# Altium schematic sheet ethernet.SchDoc
size A
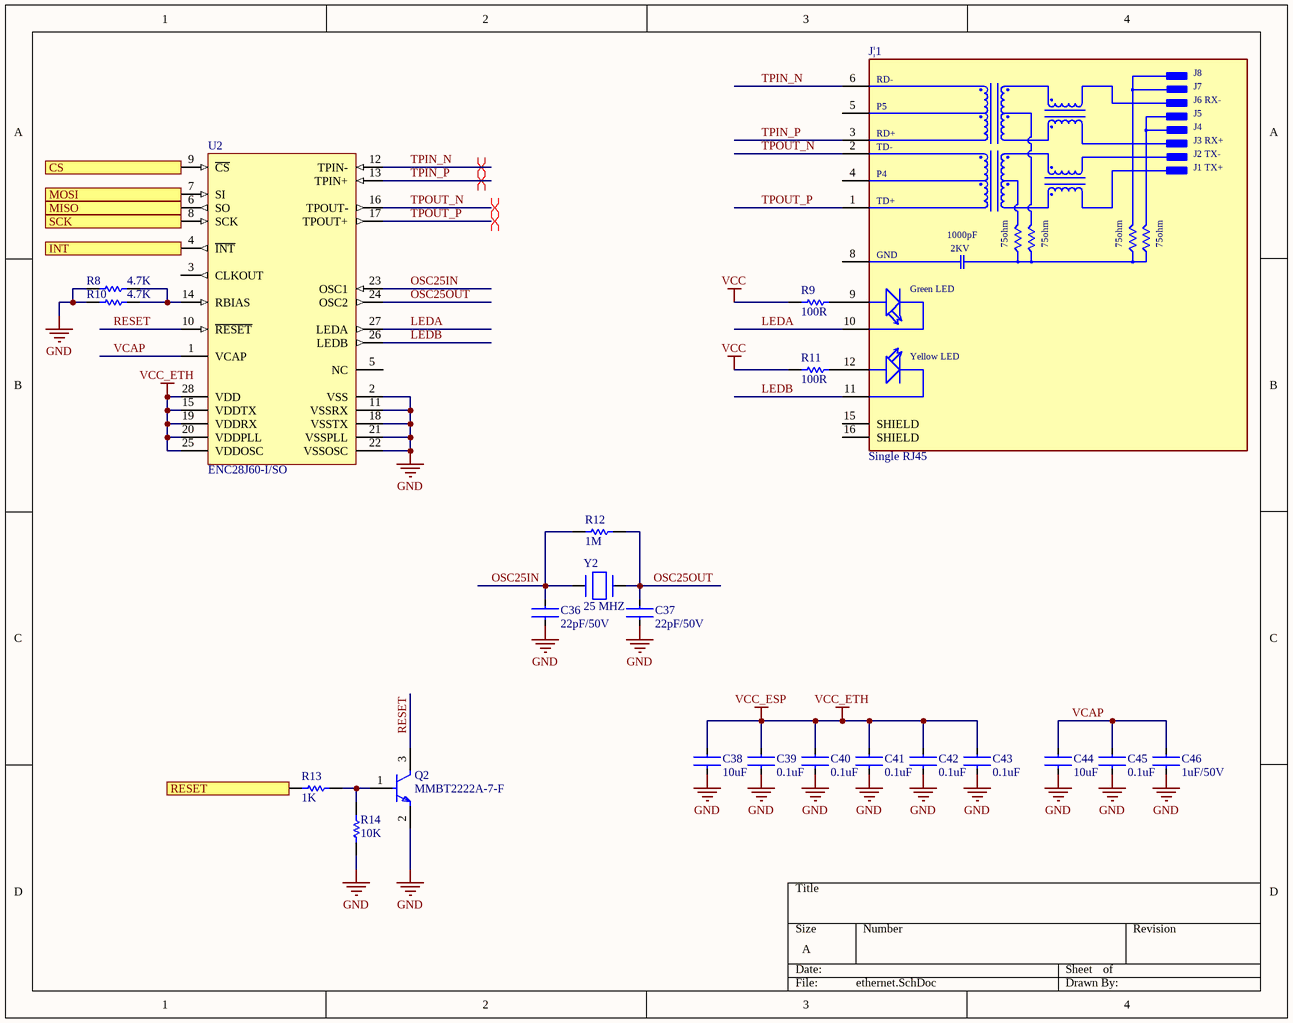
[diagram p0: ethernet.SchDoc]

## Parts
C36  22pF/50V  [C0402]
C37  22pF/50V  [C0402]
C38  10uF  [C0402]
C39  0.1uF  [C0402]
C40  0.1uF  [C0402]
C41  0.1uF  [C0402]
C42  0.1uF  [C0402]
C43  0.1uF  [C0402]
C44  10uF  [C0402]
C45  0.1uF  [C0402]
C46  1uF/50V  [C0402]
J|1  Single RJ45  [HANRUN_HR911105A]
Q2  MMBT2222A-7-F  [Diodes_SOT23_IPC_B]
R8  4.7K  [R0402]
R9  100R  [R0402]
R10  4.7K  [R0402]
R11  100R  [R0402]
R12  1M  [R0402]
R13  1K  [R0402]
R14  10K  [R0402]
U2  ENC28J60-I/SO  [SOIC-SO28_N]
Y2  25 MHZ  [CTS_ATS080B_0]

## Ports
CS, INT, MISO, MOSI, RESET, SCK

## Nets
GND: C36.2 C37.2 C38.2 C39.2 C40.2 C41.2 C42.2 C43.2 C44.2 C45.2 C46.2 Q2.2(E) R8.1 R10.1 R14.1 U2.2(VSS) U2.11(VSSRX) U2.18(VSSTX) U2.21(VSSPLL) U2.22(VSSOSC)
VCC: R9.1 R11.1
VCC_ESP: C38.1 C39.1 C40.1 C41.1 C42.1 C43.1 U2.15(VDDTX) U2.19(VDDRX) U2.20(VDDPLL) U2.25(VDDOSC) U2.28(VDD)  [also labelled VCC_ETH]
CS: U2.9(~{CS}) ; port CS
INT: U2.4(~{INT}) ; port INT
LEDA: J|1.10(GC) U2.27(LEDA)
LEDB: J|1.11(YC) U2.26(LEDB)
MISO: U2.6(SO) ; port MISO
MOSI: U2.7(SI) ; port MOSI
OSC25IN: C36.1 R12.1 U2.23(OSC1) Y2.1
OSC25OUT: C37.1 R12.2 U2.24(OSC2) Y2.2
RESET: Q2.3(C) U2.10(~{RESET})
RESET: R13.1 ; port RESET  [a separate net that carries the same name]
SCK: U2.8(SCK) ; port SCK
TPIN_N: J|1.6(RD-) U2.12(TPIN-)
TPIN_P: J|1.3(RD+) U2.13(TPIN+)
TPOUT_N: J|1.2(TD-) U2.16(TPOUT-)
TPOUT_P: J|1.1(TD+) U2.17(TPOUT+)
VCAP: C44.1 C45.1 C46.1 U2.1(VCAP)
NetJ|1_9: J|1.9(GA) R9.2
NetJ|1_12: J|1.12(YA) R11.2
NetQ2_1: Q2.1(B) R13.2 R14.2
NetR8_2: R8.2 R10.2 U2.14(RBIAS)

Not connected (* = marked no-connect by the designer): J|1 4(P4) 5(P5) 8(GND) 15(SHIELD) 16(SHIELD); U2 3(CLKOUT) 5(NC)

## Layout directives
differential pair: TPIN_N, TPIN_P, TPOUT_N, TPOUT_P

## Notes on the sheet
- (in symbol HR911105A) J8; J7; J6 RX-; J5; J4; J3 RX+; J2 TX-; J1 TX+; 1000pF; 75ohm; 2KV; Green LED; Yellow LED

## Library data of the parts
C36 C37 = CL31C220JBCNNNC: Cap Ceramic 22pF 50V C0G 5% SMD 1206 125°C Paper T/R; Manufacturer: Samsung; Temperature Coefficient: 300ppm/°C; Supplier 1: Arrow Electronics; Manufacturer Part Number: CL31C220JBCNNNC; RoHS: Yes; Category: Ceramic Capacitors; Stock 1: 470; Pricing 1: 1=0.13340, 10=0.08580, 25=0.08490, 100=0.04720, 250=0.04670 (USD); Mount: Surface Mount; Case/Package: 1206; Case Code (Metric): 3216; Case Code (Imperial): 1206; Material: Ceramic; Min Operating Temperature: -55°C; Max Operating Temperature: 125°C; Capacitance: 22pF; Tolerance: 5%; Dielectric: C0G; Voltage Rating: 50V; Package Quantity: 1; Packaging: Tape and Reel; Voltage: 50V; Voltage Rating (DC): 50V; Series: CL; Construction: Flat; Length: 3.2mm; Width: 0.063inch; Height: 0.85mm; Depth: 1.6mm; Thickness: 0.039inch; Radiation Hardening: No; Lead Free: Lead Free; RoHS Compliant: Yes; ComponentLink1URL: https://datasheet.ciiva.com/25799/cl31c220jbcnnnc-25799089.pdf?src-supplier=Digi-Key; ComponentLink1Description: https://datasheet.ciiva.com/25799/cl31c220jbcnnnc-25799089.pdf?src-supplier=Digi-Key; ComponentLink2URL: https://datasheet.ciiva.com/29201/452314-da-01-en-vs-kondensator-1206-29201377.pdf?src-supplier=Conrad; ComponentLink2Description: https://datasheet.ciiva.com/29201/452314-da-01-en-vs-kondensator-1206-29201377.pdf?src-supplier=Conrad; Supplier Part Number 1: CL31C220JBCNNNC
C38 C44 = CL31B106KOHNNNE: Cap Ceramic 10uF 16V X7R 10% Pad SMD 1206 125°C T/R; Manufacturer: Samsung; Supplier 1: Future Electronics; Manufacturer Part Number: CL31B106KOHNNNE; RoHS: Yes; Category: Ceramic Capacitors; Stock 1: 116000; Pricing 1: 2000=0.03800, 6000=0.03460, 8000=0.03450, 20000=0.03420, 30000=0.03400 (USD); Mount: Surface Mount; Case/Package: 1206; Case Code (Metric): 3216; Case Code (Imperial): 1206; Material: Ceramic; Contact Plating: Tin; Min Operating Temperature: -55°C; Max Operating Temperature: 125°C; Capacitance: 10uF; Tolerance: 10%; Dielectric: X7R; Package Quantity: 1; Packaging: Tape and Reel; Voltage Rating: 16V; Series: CL; Length: 3.2mm; Width: 0.063inch; Height: 1.6mm; Thickness: 0.071inch; Depth: 1.6mm; RoHS Compliant: Yes; ComponentLink1URL: https://datasheet.ciiva.com/25795/cl31b106kohnnne-25795201.pdf?src-supplier=Digi-Key; ComponentLink1Description: https://datasheet.ciiva.com/25795/cl31b106kohnnne-25795201.pdf?src-supplier=Digi-Key; ComponentLink2URL: https://datasheet.ciiva.com/29201/452535-da-01-en-vs-kondensator-1206-29201132.pdf?src-supplier=Conrad; ComponentLink2Description: https://datasheet.ciiva.com/29201/452535-da-01-en-vs-kondensator-1206-29201132.pdf?src-supplier=Conrad; Supplier Part Number 1: 2558872
C39-C43 C45 = CL31B104KBCNNNC: Ceramic capacitor SMD-1206 100nF /50V X7R# K +-10%, Samsung, RoHS; Tolerance: 10%; Dielectric: X7R; Voltage: 50V; Supplier 1: Arrow Electronics; Manufacturer: Samsung; Manufacturer Part Number: CL31B104KBCNNNC; RoHS: Yes; Category: Ceramic Capacitors; Stock 1: 3508000; Pricing 1: 4000=0.02060, 8000=0.01660 (USD); Mount: Surface Mount; Case/Package: 1206; Case Code (Metric): 3216; Case Code (Imperial): 1206; Material: Ceramic; Contact Plating: Tin; Min Operating Temperature: -55°C; Max Operating Temperature: 125°C; Capacitance: 100nF; Voltage Rating (DC): 50V; Packaging: Tape and Reel; Voltage Rating: 50V; Series: CL; Length: 3.2mm; Width: 0.063inch; Height: 0.85mm; Depth: 1.6mm; Thickness: 0.037inch; Radiation Hardening: No; Lead Free: Lead Free; RoHS Compliant: Yes; ComponentLink1URL: https://datasheet.ciiva.com/25710/cl31b104kbcnnnc-25710293.pdf?src-supplier=Digi-Key; ComponentLink1Description: https://datasheet.ciiva.com/25710/cl31b104kbcnnnc-25710293.pdf?src-supplier=Digi-Key; ComponentLink2URL: https://datasheet.ciiva.com/29201/451941-da-01-en-vs-kondensator-1206-29201689.pdf?src-supplier=Conrad; ComponentLink2Description: https://datasheet.ciiva.com/29201/451941-da-01-en-vs-kondensator-1206-29201689.pdf?src-supplier=Conrad; ComponentLink3URL: https://datasheet.ciiva.com/16298/cl05b104kq5nnnc-16298186.pdf?src-supplier=Future+Electronics; ComponentLink3Description: https://datasheet.ciiva.com/16298/cl05b104kq5nnnc-16298186.pdf?src-supplier=Future+Electronics; Supplier Part Number 1: CL31B104KBCNNNC
C46 = CL31B105KBHNNNE: CAP CER 1UF 50V X7R 1206; Manufacturer: Samsung; Material: Ceramic; Tolerance: 10%; Supplier 1: Arrow Electronics; Manufacturer Part Number: CL31B105KBHNNNE; RoHS: Yes; Category: Ceramic Capacitors; Stock 1: 2628000; Pricing 1: 2000=0.02720, 4000=0.02450, 10000=0.02260 (USD); Mount: Surface Mount; Case/Package: 1206; Case Code (Metric): 3216; Case Code (Imperial): 1206; Contact Plating: Tin; Min Operating Temperature: -55°C; Max Operating Temperature: 125°C; Capacitance: 1uF; Dielectric: X7R; Voltage Rating: 50V; Packaging: Tape and Reel; Package Quantity: 1; Voltage: 50V; Voltage Rating (DC): 50V; Series: CL; Construction: Flat; Length: 3.2mm; Width: 0.063inch; Height: 1.6mm; Thickness: 0.071inch; Depth: 1.6mm; Radiation Hardening: No; Lead Free: Lead Free; RoHS Compliant: Yes; ComponentLink1URL: https://datasheet.ciiva.com/25729/cl31b105kbhnnne-25729445.pdf?src-supplier=Digi-Key; ComponentLink1Description: https://datasheet.ciiva.com/25729/cl31b105kbhnnne-25729445.pdf?src-supplier=Digi-Key; ComponentLink2URL: https://datasheet.ciiva.com/16330/cl31b105kbhnnne-16330112.pdf?src-supplier=Future+Electronics; ComponentLink2Description: https://datasheet.ciiva.com/16330/cl31b105kbhnnne-16330112.pdf?src-supplier=Future+Electronics; ComponentLink3URL: https://datasheet.ciiva.com/26838/getdatasheetpartid-357471-26838902.pdf?src-supplier=Verical; ComponentLink3Description: https://datasheet.ciiva.com/26838/getdatasheetpartid-357471-26838902.pdf?src-supplier=Verical; ComponentLink4URL: https://datasheet.ciiva.com/29200/453294-da-01-en-vs-kondensator-1206-29200453.pdf?src-supplier=Conrad; ComponentLink4Description: https://datasheet.ciiva.com/29200/453294-da-01-en-vs-kondensator-1206-29200453.pdf?src-supplier=Conrad; Supplier Part Number 1: CL31B105KBHNNNE
J|1 = HR911105A: HR911105A Ethernet Interface Arduino Platform Evaluation Expansion Board; MF: DFRobot; Package: None; Availability: Unavailable; MP: HR911105A; Value: *; SnapEDA_Link: https://www.snapeda.com/parts/HR911105A/DFRobot/view-part/214807/?ref=snap; Price: None
Q2 = MMBT2222A-7-F: NPN Ic=600mA Vceo=40V hfe=100~300 fT=300MHz P=310mW SOT-23; Manufacturer: Diodes; hFE Min: 100; Frequency: 300MHz; Max Power Dissipation: 300mW; Number of Elements: 1; Collector Emitter Voltage (VCEO): 40V; Collector Base Voltage (VCBO): 75V; Emitter Base Voltage (VEBO): 6V; Collector Emitter Saturation Voltage: 1V; Max Collector Current: 600mA; Power Dissipation: 350mW; Element Configuration: Single; Current: 1A; Supplier 1: RSComponents; Manufacturer Part Number: MMBT2222A-7-F; RoHS: Yes; Category: BJTs; Stock 1: 3000; Pricing 1: 3000=0.02700, 6000=0.02500, 12000=0.02400, 30000=0.02300, 60000=0.02100 (USD); Mount: Surface Mount; Case/Package: SOT-23; Number of Pins: 3; Weight: 0.000282oz; Contact Plating: Tin,Matte; Min Operating Temperature: -55°C; Max Operating Temperature: 150°C; Polarity: NPN; Packaging: Tape and Reel; Package Quantity: 3000; Continuous Collector Current: 600mA; Collector Emitter Breakdown Voltage: 40V; Transition Frequency: 300MHz; Max Breakdown Voltage: 40V; Max Frequency: 300MHz; Termination: SMD/SMT; Gain Bandwidth Product: 300MHz; Voltage Rating (DC): 40V; Current Rating: 600mA; Voltage: 40V; Collector-emitter Voltage-Max: 1V; Series: -; Length: 3.05mm; Width: 1.4mm; Height: 1mm; Radiation Hardening: No; REACH SVHC: No SVHC; Lead Free: Lead Free; RoHS Compliant: Yes; ComponentLink1URL: https://datasheet.ciiva.com/15139/getdatasheetpartid-82692-15139078.pdf?src-supplier=Verical; ComponentLink1Description: https://datasheet.ciiva.com/15139/getdatasheetpartid-82692-15139078.pdf?src-supplier=Verical; ComponentLink2URL: https://datasheet.ciiva.com/8029/ds30041-8029709.pdf?src-supplier=Element14; ComponentLink2Description: https://datasheet.ciiva.com/8029/ds30041-8029709.pdf?src-supplier=Element14; ComponentLink3URL: https://datasheet.ciiva.com/11201/ds30041-11201864.pdf?src-supplier=Avnet; ComponentLink3Description: https://datasheet.ciiva.com/11201/ds30041-11201864.pdf?src-supplier=Avnet; ComponentLink4URL: https://datasheet.ciiva.com/16199/ds30041-16199045.pdf?src-supplier=Future+Electronics; ComponentLink4Description: https://datasheet.ciiva.com/16199/ds30041-16199045.pdf?src-supplier=Future+Electronics; ComponentLink5URL: https://datasheet.ciiva.com/11198/ds30041-11198965.pdf?src-supplier=Avnet; ComponentLink5Description: https://datasheet.ciiva.com/11198/ds30041-11198965.pdf?src-supplier=Avnet; ComponentLink6URL: https://datasheet.ciiva.com/972/ds30041-972551.pdf?src-supplier=Digi-Key; ComponentLink6Description: https://datasheet.ciiva.com/972/ds30041-972551.pdf?src-supplier=Digi-Key; ComponentLink7URL: https://datasheet.ciiva.com/972/ds30041-972552.pdf?src-supplier=Digi-Key; ComponentLink7Description: https://datasheet.ciiva.com/972/ds30041-972552.pdf?src-supplier=Digi-Key; ComponentLink8URL: https://datasheet.ciiva.com/972/ds30041-972550.pdf?src-supplier=Digi-Key; ComponentLink8Description: https://datasheet.ciiva.com/972/ds30041-972550.pdf?src-supplier=Digi-Key; Supplier Part Number 1: 1219442
R8 R10 = RC1206FR-074K7L: Res Thick Film 3.2 x 1.6 mm 4.7K Ohm 1% 0.25W(1/4W) 100ppm/ C Molded SMD Paper T/R; Manufacturer: Yageo; Voltage Rating (DC): 200V; Resistance: 4.7kR; Temperature Coefficient: 100ppm/°C; Power Rating: 250mW; Supplier 1: Arrow Electronics; Manufacturer Part Number: RC1206FR-074K7L; RoHS: Yes; Category: Chip SMD Resistors; Stock 1: 2350000; Pricing 1: 5000=0.00460 (USD); Case/Package: 1206; Number of Pins: 2; Case Code (Imperial): 1206; Case Code (Metric): 3216; Size Code: 1206; Min Operating Temperature: -55°C; Max Operating Temperature: 155°C; Tolerance: 1%; Packaging: Tape and Reel; Resistor Type: Thick Film; Voltage Rating: 200V; Package Quantity: 1; Termination: SMD/SMT; Number of Terminations: 2; Max Power Dissipation: 250mW; Features: Moisture Resistant; Series: RC; Resistance Tolerance: 1%; Construction: Rectangular; Length: 0.122inch; Width: 0.063inch; Height: 0.026inch; Depth: 1.6mm; REACH SVHC: Unknown; Lead Free: Lead Free; Military Standard: Not; RoHS Compliant: Yes; Supplier Part Number 1: RC1206FR-074K7L
R9 R11 = RC1206FR-07100RL: Res General Purpose Thick Film 1206 100 Ohm 1% 1/4W ±100ppm/°C Molded SMD Paper T/R; Manufacturer: Yageo; Power Rating: 250mW; Voltage Rating: 200V; Supplier 1: Arrow Electronics; Manufacturer Part Number: RC1206FR-07100RL; RoHS: Yes; Category: Chip SMD Resistors; Stock 1: 15950000; Pricing 1: 5000=0.00540, 10000=0.00450 (USD); Case/Package: 1206; Case Code (Imperial): 1206; Case Code (Metric): 3216; Size Code: 1206; Min Operating Temperature: -55°C; Max Operating Temperature: 155°C; Tolerance: 1%; Packaging: Tape and Reel; Resistance: 100R; Package Quantity: 5000; Termination: SMD/SMT; Resistor Type: Thick Film; Temperature Coefficient: 100ppm/°C; Features: Moisture Resistant; Series: RC; Max Power Dissipation: 250mW; Number of Terminations: 2; Resistance Tolerance: 1%; Technology: THICK FILM; Length: 3.1mm; Width: 1.6mm; Height: 0.55mm; Depth: 1.6mm; REACH SVHC: Unknown; Lead Free: Lead Free; RoHS Compliant: Yes; ComponentLink1URL: https://datasheet.ciiva.com/11808/0900766b80c6630a-11808606.pdf?src-supplier=RSComponents; ComponentLink1Description: https://datasheet.ciiva.com/11808/0900766b80c6630a-11808606.pdf?src-supplier=RSComponents; ComponentLink2URL: https://datasheet.ciiva.com/46445/444357-46445702.pdf?src-supplier=Element14; ComponentLink2Description: https://datasheet.ciiva.com/46445/444357-46445702.pdf?src-supplier=Element14; ComponentLink3URL: https://datasheet.ciiva.com/7857/444357-7857241.pdf?src-supplier=Element14; ComponentLink3Description: https://datasheet.ciiva.com/7857/444357-7857241.pdf?src-supplier=Element14; ComponentLink4URL: https://datasheet.ciiva.com/7857/444357-7857242.pdf?src-supplier=Element14; ComponentLink4Description: https://datasheet.ciiva.com/7857/444357-7857242.pdf?src-supplier=Element14; Supplier Part Number 1: RC1206FR-07100RL
R12 = RC1206FR-071ML: Res Thick Film 1206 1M Ohm 1% 0.25W(1/4W) ±100ppm/°C Epoxy Pad SMD T/R; Manufacturer: Yageo; Resistance: 1MR; Power Rating: 250mW; Voltage Rating: 200V; Supplier 1: Arrow Electronics; Manufacturer Part Number: RC1206FR-071ML; RoHS: Yes; Category: Chip SMD Resistors; Stock 1: 90000; Pricing 1: 5000=0.01560, 10000=0.01040, 25000=0.01030 (USD); Case/Package: 1206; Case Code (Imperial): 1206; Case Code (Metric): 3216; Size Code: 1206; Min Operating Temperature: -55°C; Max Operating Temperature: 155°C; Tolerance: 1%; Packaging: Tape and Reel; Temperature Coefficient: 100ppm/°C; Resistor Type: Thick Film; Package Quantity: 5000; Termination: SMD/SMT; Features: Moisture Resistant; Series: RC; Max Power Dissipation: 250mW; Number of Terminations: 2; Technology: THICK FILM; Resistance Tolerance: 1%; Construction: Rectangular; Length: 3.1mm; Width: 1.6mm; Height: 0.55mm; Depth: 1.6mm; REACH SVHC: Unknown; Lead Free: Lead Free; Military Standard: Not; RoHS Compliant: Yes; ComponentLink1URL: https://datasheet.ciiva.com/11819/0900766b80c6630a-11819912.pdf?src-supplier=RSComponents; ComponentLink1Description: https://datasheet.ciiva.com/11819/0900766b80c6630a-11819912.pdf?src-supplier=RSComponents; ComponentLink2URL: https://datasheet.ciiva.com/46445/444357-46445709.pdf?src-supplier=Element14; ComponentLink2Description: https://datasheet.ciiva.com/46445/444357-46445709.pdf?src-supplier=Element14; ComponentLink3URL: https://datasheet.ciiva.com/7857/444357-7857289.pdf?src-supplier=Element14; ComponentLink3Description: https://datasheet.ciiva.com/7857/444357-7857289.pdf?src-supplier=Element14; ComponentLink4URL: https://datasheet.ciiva.com/7857/444357-7857288.pdf?src-supplier=Element14; ComponentLink4Description: https://datasheet.ciiva.com/7857/444357-7857288.pdf?src-supplier=Element14; ComponentLink5URL: https://datasheet.ciiva.com/17033/pyu-rc1206-51-rohs-l-4-17033611.pdf?src-supplier=Future+Electronics; ComponentLink5Description: https://datasheet.ciiva.com/17033/pyu-rc1206-51-rohs-l-4-17033611.pdf?src-supplier=Future+Electronics; Supplier Part Number 1: RC1206FR-071ML
R13 = RC1206FR-071KL: In a Pack of 5000, 1K 1206 Thick Film SMD Resistor ±1% 0.25W - RC1206FR-071KL; Manufacturer: Yageo; Resistance: 1kR; Power Rating: 250mW; Voltage Rating: 200V; Temperature Coefficient: 100ppm/°C; Supplier 1: Arrow Electronics; Manufacturer Part Number: RC1206FR-071KL; RoHS: Yes; Category: Chip SMD Resistors; Stock 1: 535000; Pricing 1: 5000=0.00940, 10000=0.00890 (USD); Case/Package: 1206; Case Code (Imperial): 1206; Case Code (Metric): 3216; Size Code: 1206; Min Operating Temperature: -55°C; Max Operating Temperature: 155°C; Tolerance: 1%; Packaging: Tape and Reel; Resistor Type: Thick Film; Termination: SMD/SMT; Series: RC; Resistance Tolerance: 1%; Construction: Rectangular; Technology: THICK FILM; Length: 3.1mm; Height: 0.55mm; Depth: 1.6mm; REACH SVHC: Unknown; Military Standard: Not; Lead Free: Lead Free; RoHS Compliant: Yes; ComponentLink1URL: https://datasheet.ciiva.com/11808/0900766b80c6630a-11808217.pdf?src-supplier=RSComponents; ComponentLink1Description: https://datasheet.ciiva.com/11808/0900766b80c6630a-11808217.pdf?src-supplier=RSComponents; ComponentLink2URL: https://datasheet.ciiva.com/29181/402540-da-01-en-smd-widerstand-chip1206-1-kohm-29181462.pdf?src-supplier=Conrad; ComponentLink2Description: https://datasheet.ciiva.com/29181/402540-da-01-en-smd-widerstand-chip1206-1-kohm-29181462.pdf?src-supplier=Conrad; ComponentLink3URL: https://datasheet.ciiva.com/46445/444357-46445708.pdf?src-supplier=Element14; ComponentLink3Description: https://datasheet.ciiva.com/46445/444357-46445708.pdf?src-supplier=Element14; Supplier Part Number 1: RC1206FR-071KL
R14 = RC1206FR-0710KL: Res Thick Film 1206 10K Ohm 1% 0.25W(1/4W) ±100ppm/C Pad SMD T/R; Manufacturer: Yageo; Resistance: 10kR; Temperature Coefficient: 100ppm/°C; Power Rating: 250mW; Voltage Rating: 200V; Supplier 1: Arrow Electronics; Manufacturer Part Number: RC1206FR-0710KL; RoHS: Yes; Category: Chip SMD Resistors; Stock 1: 10000; Pricing 1: 5000=0.00970 (USD); Case/Package: 1206; Case Code (Imperial): 1206; Case Code (Metric): 3216; Size Code: 1206; Min Operating Temperature: -55°C; Max Operating Temperature: 155°C; Tolerance: 1%; Packaging: Tape and Reel; Resistor Type: Thick Film; Package Quantity: 5000; Termination: SMD/SMT; Features: Moisture Resistant; Series: RC; Max Power Dissipation: 250mW; Number of Terminations: 2; Resistance Tolerance: 1%; Construction: Rectangular; Length: 3.1mm; Width: 1.6mm; Height: 0.55mm; Depth: 1.6mm; REACH SVHC: Unknown; Lead Free: Lead Free; Military Standard: Not; RoHS Compliant: Yes; ComponentLink1URL: https://datasheet.ciiva.com/46445/444357-46445703.pdf?src-supplier=Element14; ComponentLink1Description: https://datasheet.ciiva.com/46445/444357-46445703.pdf?src-supplier=Element14; ComponentLink2URL: https://datasheet.ciiva.com/7857/1692832-7857244.pdf?src-supplier=Element14; ComponentLink2Description: https://datasheet.ciiva.com/7857/1692832-7857244.pdf?src-supplier=Element14; ComponentLink3URL: https://datasheet.ciiva.com/7857/1692832-7857245.pdf?src-supplier=Element14; ComponentLink3Description: https://datasheet.ciiva.com/7857/1692832-7857245.pdf?src-supplier=Element14; Supplier Part Number 1: RC1206FR-0710KL
U2 = ENC28J60-I/SO: Stand-Alone Ethernet Controller with SPI Interface, 28-Pin SOIC, Industrial Temperature; ComponentLink1Description: Manufacturer URL; ComponentLink2Description: Datasheet; DatasheetVersion: revC, Jan-2008; ComponentLink3URL: http://www.microchip.com/stellent/groups/techpub_sg/documents/packagingspec/en012702.pdf; ComponentLink3Description: Package Specification; ComponentLink1URL: http://www.microchip.com/; Code_JEDEC: MS-013; RevisionNote: URLs added.; PackageVersion: revBB, Aug-2009; PackageDescription: 28-Lead Plastic Small Outline (SO) - Wide 7.50mm Body [SOIC]; ComponentLink2URL: http://ww1.microchip.com/downloads/en/DeviceDoc/39662c.pdf; PackageReference: SOIC-SO28; PartNumber: ENC28J60-I/SO; Supplier 1: RSComponents; Supplier Part Number 1: 6988987
Y2 = CRYSTAL 25.000MHZ: CRYSTAL 25.000MHZ 20PF THRU; Manufacturer: TXC; Manufacturer Part Number: 9B-8.000MBBK-B; Frequency Stability: 50ppm; Frequency: 8MHz; ESR (Equivalent Series Resistance): 80R; Supplier 1: Digi-Key; RoHS: Yes; Category: Crystals; Pricing 1: 1000=0.16000 (USD); Mount: Through Hole; Case/Package: Metal; Min Operating Temperature: -20°C; Max Operating Temperature: 70°C; Package Quantity: 1000; Frequency Tolerance: 50ppm; Load Capacitance: 20pF; Packaging: Bulk; Length: 0.453inch; Width: 0.197inch; Height: 0.145inch; ComponentLink1URL: https://datasheet.ciiva.com/6733/9b-6733750.pdf?src-supplier=Digi-Key; ComponentLink1Description: https://datasheet.ciiva.com/6733/9b-6733750.pdf?src-supplier=Digi-Key; ComponentLink2URL: https://datasheet.ciiva.com/29631/9b-29631174.pdf?src-supplier=Digi-Key; ComponentLink2Description: https://datasheet.ciiva.com/29631/9b-29631174.pdf?src-supplier=Digi-Key; Supplier Part Number 1: 887-2033-ND